# EAGLE schematic untitled (EAGLE 7.6.0)
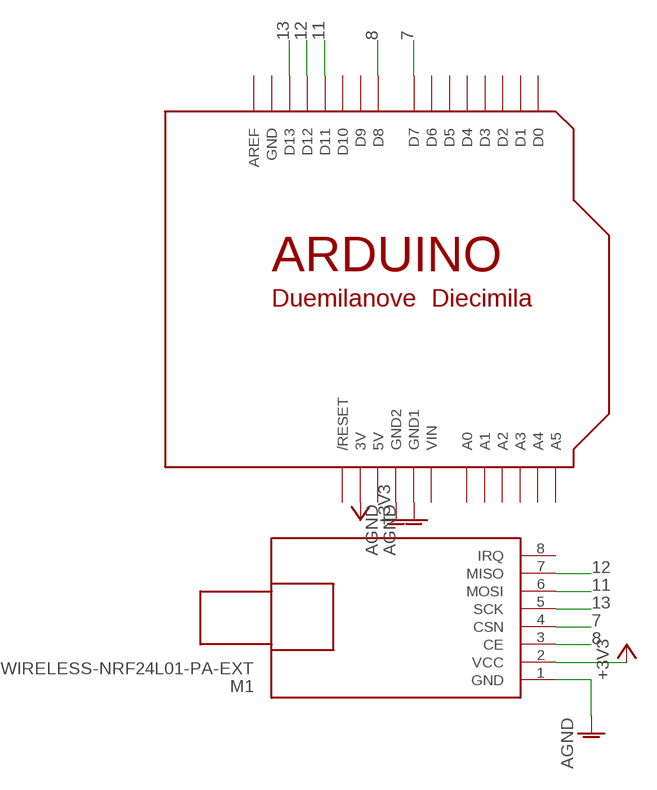
[diagram p0: schematic, sheet 1]

## Parts
M1  WIRELESS-NRF24L01-PA-EXT  [WIRELESS-NRF24L01-PA-EXT]
U$1  ARDUINODUEMILANOVE  [ARDUINO]

## Nets
7: M1.4(CSN) U$1.D7
8: M1.3(CE) U$1.D8
11: M1.6(MOSI) U$1.D11
12: M1.7(MISO) U$1.D12
13: M1.5(SCK) U$1.D13
+3V3: M1.2(VCC) U$1.3V
AGND: M1.1(GND) U$1.GND1 U$1.GND2
Unconnected: M1.8(IRQ) U$1.A0 U$1.A1 U$1.A2 U$1.A3 U$1.A4 U$1.A5 U$1.AREF U$1.D0 U$1.D1 U$1.D2 U$1.D3 U$1.D4 U$1.D5 U$1.D6 U$1.D9 U$1.D10 U$1.RESET(/RESET)

## Power pins joined to a net without a drawn wire
5V: U$1.5V
GND: U$1.GND
VIN: U$1.VIN

## Library data of the parts
M1 = diy-modules:WIRELESS-NRF24L01-PA-EXT: 2.4 GHz Wireless Module based on NRF24L01 chip with preamplifier and external antenna Click here to find device on ebay.com <http://www.ebay.com/sch/nrf24l01+pa+lna+sma>
U$1 = microbuilder:ARDUINO: Arduino Diecimila/Duemilanove Make a shield with ease, this package has all the named pins as well as the two mounting drill holes and an outline of the USB and DC power connector. The outline is on the DIMENSION layer, so if your board house uses it they will cut the outline to match. http://www.ladyada.net/library/pcb/eaglelibrary.html